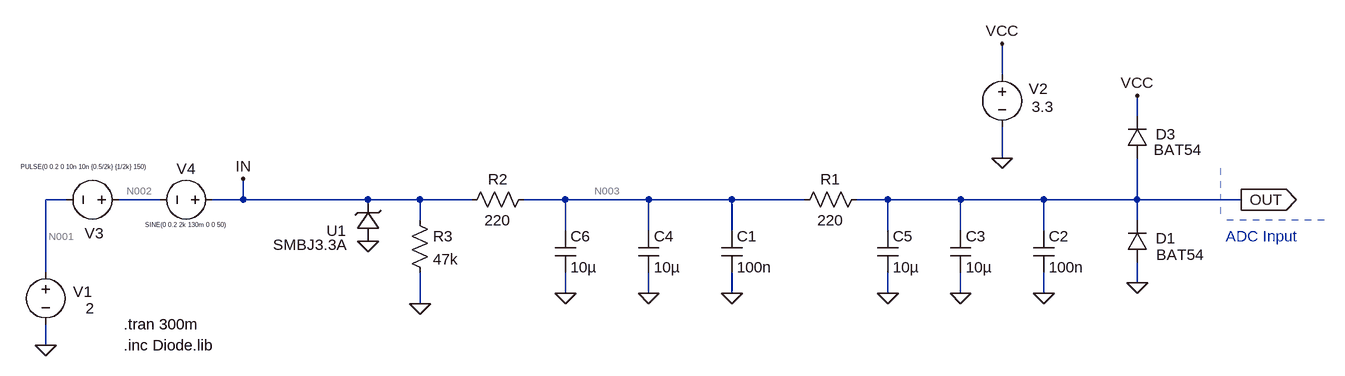
[diagram p0: schematic v2.0.asc]
v2.0.asc, the LTspice schematic file:
Version 4.1
SHEET 1 1508 680
WIRE 848 -64 848 -112
WIRE 1056 0 1056 -32
WIRE 848 64 848 16
WIRE -592 128 -624 128
WIRE -448 128 -512 128
WIRE -320 128 -320 96
WIRE -320 128 -368 128
WIRE -128 128 -320 128
WIRE -48 128 -128 128
WIRE 32 128 -48 128
WIRE 176 128 112 128
WIRE 304 128 176 128
WIRE 432 128 304 128
WIRE 544 128 432 128
WIRE 672 128 624 128
WIRE 784 128 672 128
WIRE 912 128 784 128
WIRE 1056 128 1056 64
WIRE 1056 128 912 128
WIRE 1216 128 1056 128
WIRE -48 160 -48 128
WIRE 1056 160 1056 128
WIRE 176 176 176 128
WIRE 304 176 304 128
WIRE 432 176 432 128
WIRE 672 176 672 128
WIRE 784 176 784 128
WIRE 912 176 912 128
WIRE -624 240 -624 128
WIRE 1056 256 1056 224
WIRE 176 272 176 240
WIRE 304 272 304 240
WIRE 432 272 432 240
WIRE 672 272 672 240
WIRE 784 272 784 240
WIRE 912 272 912 240
WIRE -48 288 -48 240
WIRE -624 352 -624 320
FLAG -624 352 0
FLAG 1056 256 0
FLAG 912 272 0
FLAG -320 96 IN
FLAG 1216 128 OUT
IOPIN 1216 128 Out
FLAG 848 64 0
FLAG 848 -112 VCC
FLAG 1056 -32 VCC
FLAG 784 272 0
FLAG 432 272 0
FLAG 304 272 0
FLAG -48 288 0
FLAG 672 272 0
FLAG 176 272 0
FLAG -128 192 0
SYMBOL voltage -624 224 R0
WINDOW 0 42 46 Left 2
WINDOW 3 75 71 Right 2
WINDOW 123 0 0 Left 0
WINDOW 39 0 0 Left 0
SYMATTR InstName V1
SYMATTR Value 2
SYMBOL res 640 112 R90
WINDOW 0 0 56 VBottom 2
WINDOW 3 32 56 VTop 2
SYMATTR InstName R1
SYMATTR Value 220
SYMBOL cap 896 176 R0
SYMATTR InstName C2
SYMATTR Value 100n
SYMBOL diode 1072 64 R180
WINDOW 0 -43 37 Left 2
WINDOW 3 -83 13 Left 2
SYMATTR InstName D3
SYMATTR Value BAT54
SYMBOL voltage 848 -80 R0
WINDOW 0 41 37 Left 2
WINDOW 3 46 65 Left 2
WINDOW 123 0 0 Left 0
WINDOW 39 0 0 Left 0
SYMATTR InstName V2
SYMATTR Value 3.3
SYMBOL voltage -496 128 R90
WINDOW 0 52 39 VRight 2
WINDOW 3 -51 -29 VRight 0
WINDOW 123 0 0 Left 0
WINDOW 39 0 0 Left 0
SYMATTR InstName V3
SYMATTR Value PULSE(0 0.2 0 10n 10n {0.5/2k} {1/2k} 150)
SYMBOL cap 768 176 R0
SYMATTR InstName C3
SYMATTR Value 10µ
SYMBOL res 128 112 R90
WINDOW 0 0 56 VBottom 2
WINDOW 3 32 56 VTop 2
SYMATTR InstName R2
SYMATTR Value 220
SYMBOL cap 416 176 R0
SYMATTR InstName C1
SYMATTR Value 100n
SYMBOL cap 288 176 R0
SYMATTR InstName C4
SYMATTR Value 10µ
SYMBOL res -64 144 R0
SYMATTR InstName R3
SYMATTR Value 47k
SYMBOL cap 656 176 R0
SYMATTR InstName C5
SYMATTR Value 10µ
SYMBOL cap 160 176 R0
SYMATTR InstName C6
SYMATTR Value 10µ
SYMBOL diode 1072 224 R180
WINDOW 0 -43 37 Left 2
WINDOW 3 -87 11 Left 2
SYMATTR InstName D1
SYMATTR Value BAT54
SYMBOL voltage -352 128 R90
WINDOW 0 -32 56 VBottom 2
WINDOW 3 32 56 VTop 0
WINDOW 123 0 0 Left 0
WINDOW 39 0 0 Left 0
SYMATTR InstName V4
SYMATTR Value SINE(0 0.2 2k 130m 0 0 50)
SYMBOL MyLib\\Diode_TVS\\SMBJ3.3A -112 192 R180
WINDOW 38 49 -5 Left 2
SYMATTR InstName U1
TEXT -504 320 Left 2 !.tran 300m
TEXT 1192 184 Left 2 ;ADC Input
TEXT -504 352 Left 2 !.inc Diode.lib
LINE Normal 1344 160 1184 160 2
LINE Normal 1184 80 1184 160 2

The netlist it stands for:
* v2.0.asc
V1 N001 0 2
R1 OUT N003 220
C2 OUT 0 100n
D3 OUT VCC BAT54
V2 VCC 0 3.3
V3 N002 N001 PULSE(0 0.2 0 10n 10n {0.5/2k} {1/2k} 150)
C3 OUT 0 10µ
R2 N003 IN 220
C1 N003 0 100n
C4 N003 0 10µ
R3 IN 0 47k
C5 OUT 0 10µ
C6 N003 0 10µ
D1 0 OUT BAT54
V4 IN N002 SINE(0 0.2 2k 130m 0 0 50)
X§U1 0 IN SMBJ3.3A  ; pins + -
.model D D
.lib standard.dio
.tran 300m
* ADC Input
.inc Diode.lib
.lib MyLib/Diode_TVS/SMBJ3.3.lib
.backanno
.end

* Results of the author's LTspice run, read from the files saved beside the schematic
* Operating Point, zero values left out:
*   V(in) = 2 V
*   V(n001) = 2 V
*   V(n002) = 2 V
*   V(n003) = 2 V
*   V(out) = 2 V
*   V(vcc) = 3.3 V
*   I(D1) = -100 nA
*   I(D3) = -100 nA
*   I(R3) = 42.55 µA
*   I(V1) = -223.5 µA
*   I(V2) = -100 nA
*   I(V3) = -223.5 µA
*   I(V4) = -223.5 µA
*   Ix(u1:a) = -180.9 µA
*   Ix(u1:k) = 180.9 µA
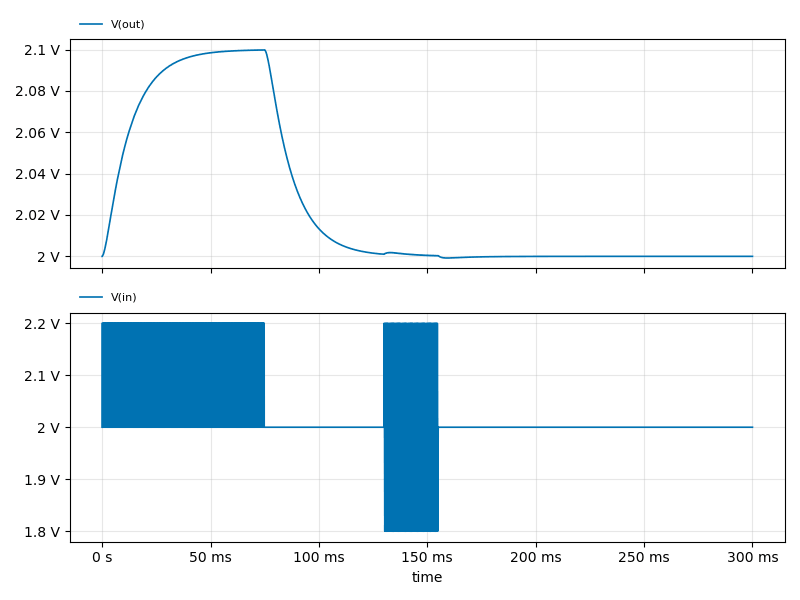
[diagram p1: Transient Analysis of v2.0.asc, plotted from the saved traces]
* Transient Analysis, 1 run:
*   V(out): min 1.999 V, max 2.1 V, average 2.025 V, rms 2.025 V, last 2 V
*   V(in): min 1.8 V, max 2.2 V, average 2.025 V, rms 2.027 V, last 2 V